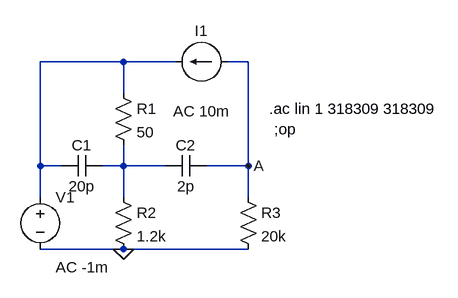
[diagram p0: schematic схема.asc]
схема.asc, the LTspice schematic file:
Version 4
SHEET 1 880 680
WIRE 96 80 -32 80
WIRE 176 80 96 80
WIRE 288 80 256 80
WIRE 96 128 96 80
WIRE -32 240 -32 80
WIRE 0 240 -32 240
WIRE 96 240 96 208
WIRE 96 240 64 240
WIRE 160 240 96 240
WIRE 288 240 288 80
WIRE 288 240 224 240
WIRE -32 288 -32 240
WIRE 96 288 96 240
WIRE 288 288 288 240
WIRE 96 368 -32 368
WIRE 288 368 96 368
FLAG 96 368 0
FLAG 288 240 A
SYMBOL current 256 80 R90
WINDOW 0 -32 40 VBottom 2
WINDOW 3 32 40 VTop 2
WINDOW 123 60 40 VTop 2
WINDOW 39 0 0 Left 2
SYMATTR InstName I1
SYMATTR Value ""
SYMATTR Value2 AC 10m
SYMBOL res 80 112 R0
SYMATTR InstName R1
SYMATTR Value 50
SYMBOL res 80 272 R0
SYMATTR InstName R2
SYMATTR Value 1.2k
SYMBOL res 272 272 R0
SYMATTR InstName R3
SYMATTR Value 20k
SYMBOL voltage -32 272 R0
WINDOW 123 24 124 Left 2
WINDOW 39 0 0 Left 2
SYMATTR InstName V1
SYMATTR Value ""
SYMATTR Value2 AC -1m
SYMBOL cap 64 224 R90
WINDOW 0 0 32 VBottom 2
WINDOW 3 32 32 VTop 2
SYMATTR InstName C1
SYMATTR Value 20p
SYMBOL cap 224 224 R90
WINDOW 0 0 32 VBottom 2
WINDOW 3 32 32 VTop 2
SYMATTR InstName C2
SYMATTR Value 2p
TEXT 328 184 Left 2 !;op
TEXT 320 152 Left 2 !.ac lin 1 318309 318309

The netlist it stands for:
* схема.asc
I1 A N001 AC 10m
R1 N001 N002 50
R2 N002 0 1.2k
R3 A 0 20k
V1 N001 0 AC -1m
C1 N002 N001 20p
C2 A N002 2p
;op
.ac lin 1 318309 318309
.backanno
.end